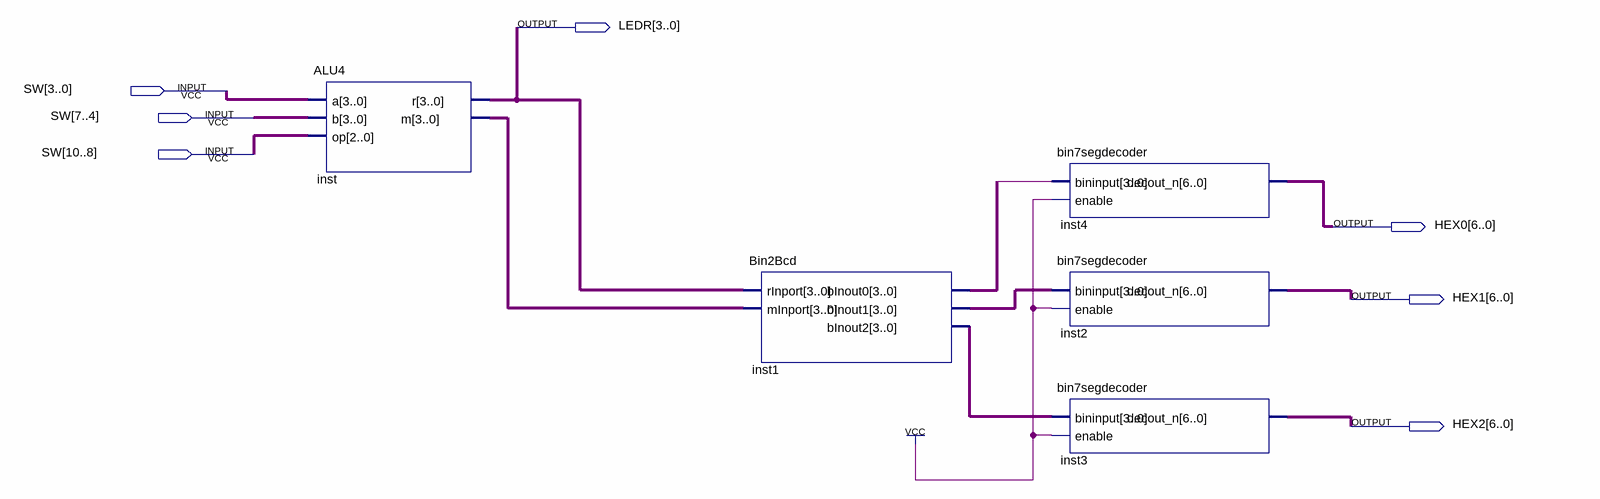
[diagram p0: schematic sheet]
// Quartus schematic ALUDemo.bdf as structural Verilog: 5 symbols, 7 pins
module ALUDemo (
  input  [10:0] SW,
  output [3:0] LEDR,
  output [6:0] HEX0,
  output [6:0] HEX1,
  output [6:0] HEX2
);

  wire undriven;
  wire [3:0] inst1_binout0, inst1_binout1, inst1_binout2, inst_m;

  ALU4 inst (.a(SW[3:0]), .b(SW[7:4]), .op(SW[10:8]), .r(LEDR), .m(inst_m));
  Bin2Bcd inst1 (
    .rInport(LEDR), .mInport(inst_m), .bInout0(inst1_binout0), .bInout1(inst1_binout1),
    .bInout2(inst1_binout2));
  bin7segdecoder inst4 (.bininput({4{undriven}}), .enable(1'b1), .decout_n(HEX0));
  bin7segdecoder inst2 (.bininput(inst1_binout1), .enable(1'b1), .decout_n(HEX1));
  bin7segdecoder inst3 (.bininput(inst1_binout2), .enable(1'b1), .decout_n(HEX2));
endmodule
